# EAGLE board LinuxBoard_v1.91 (EAGLE 7.2.0)
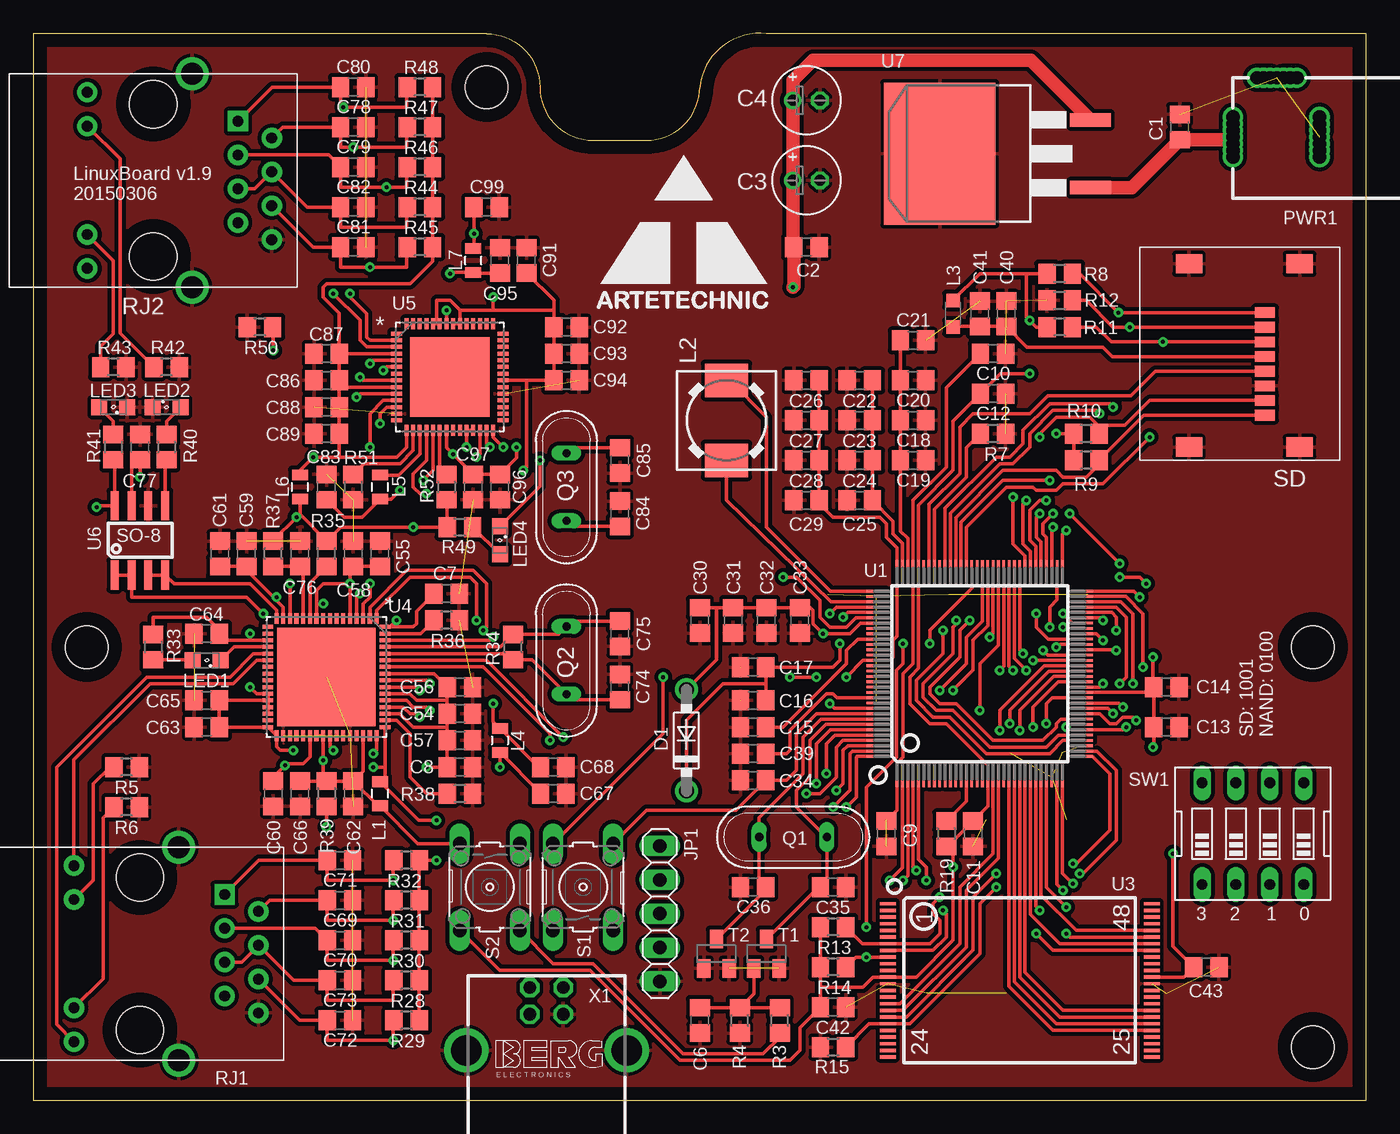
[diagram p2: board, top side]
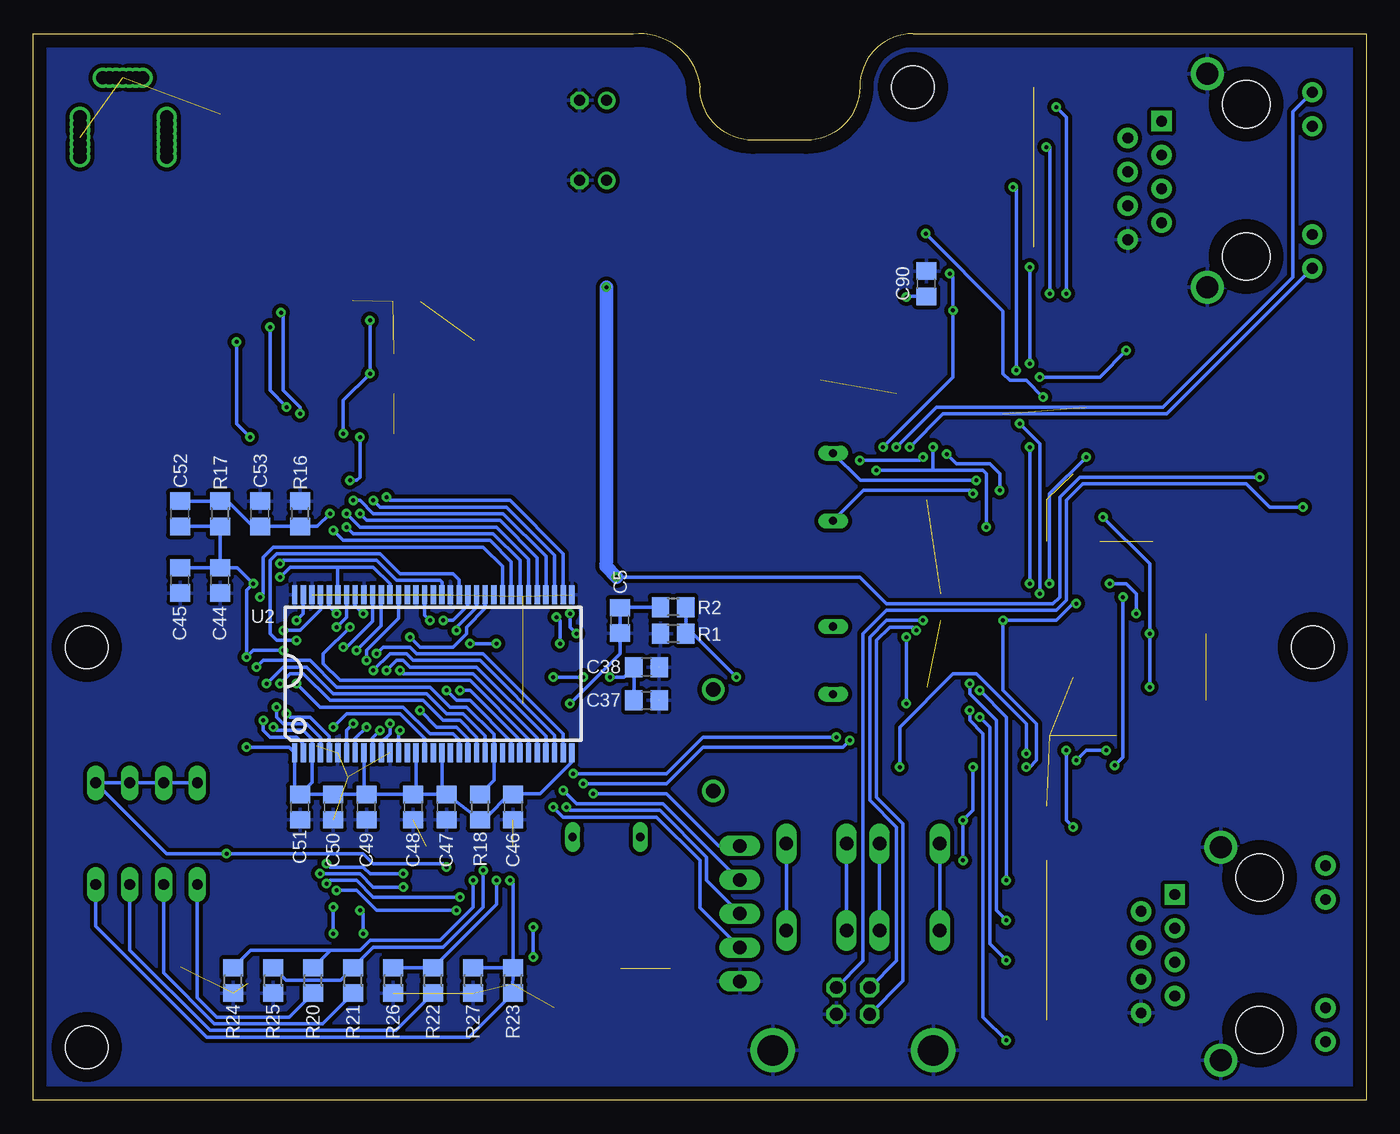
[diagram p3: board, bottom side, seen from below]

Size 100 x 80.03 mm. Coordinates in mm from the lower left corner, seen from the top.
Outline: 0,0 100,0 100,80 55,80 arc90 50,76 arc-90 46,72 42,72 arc-90 38,76 arc90 34,80 0,80 0,0
Copper layers (1*16): Top 0.035mm / dielectric 1.5mm / Bottom 0.035mm
Design rules "default *": minimum track width 10mil, minimum drill 24mil, track to track 8mil, track to pad 8mil, pad to pad 8mil, via to via 8mil, smd to smd 8mil, copper to edge 40mil, drill to drill 8mil, minimum pad ring 10mil, minimum via ring 8mil, stop-mask expansion 4mil, vias tented up to drill 12mil, thermal gap 10mil
Net classes: 1 pwr: width 0.5 mm, clearance 0.2 mm
Holes 3.2 mm at 4,34 96,34 96,4 34,76

## Footprints (pad centres in the part's own frame; a part is rotated, then mirrored left to right if it is on the bottom)
C0805 = smd 1.3 x 1.5: 1 -0.95,0; 2 0.95,0
E2-5 = drill 0.813 pad 1.27: + -1.016,0 | drill 0.813 pad 1.27 octagon: - 1.016,0
DO41-7.6 = drill 1.1 pad 1.7: A 3.81,0; C -3.81,0
1X05 = drill 1.016 long: 1 -5.08,0; 2 -2.54,0; 3 0,0; 4 2.54,0; 5 5.08,0
0805 = smd 0.8 x 1.2: 1 -0.9,0; 2 0.9,0
DR73 = smd 2.5 x 3.25: 1 -3,0; 2 3,0
L2012C = smd 1 x 1: 1 -1,0; 2 1,0
SML0805 = smd 1.2 x 1.2: A 1.05,0; C -1.05,0
PWR_JACK_UNI_MILLING = drill 1: + 0,4.75; +1 0,5.25; +2 0,5.75; +3 0,6.25; +4 0,4.25; +5 0,3.75; +6 0,3.25; - -6.5,4.75; -1 -6.5,5.25; -2 -6.5,5.75; -3 -6.5,4.25; -4 -6.5,3.75; -5 -6.5,6.25; -6 -6.5,3.25; -- -3.3,0.3; --1 -3.8,0.3; --2 -4.3,0.3; --3 -4.8,0.3; --4 -2.8,0.3; --5 -2.3,0.3; --6 -1.8,0.3
QS = drill 0.61 long: 1 -2.54,0; 2 2.54,0
R0805 = smd 1.3 x 1.5: 1 -0.95,0; 2 0.95,0
HR911105A = drill 0.813 pad 1.524: G+ 4.953,-6.604; G- 4.953,-4.064; GND -8.89,4.445; NC -6.35,3.175; P4 -8.89,-0.635; P5 -6.35,0.635; RD+ -6.35,-1.905; RD- -8.89,1.905; TD- -8.89,-3.175; Y+ 4.953,6.604; Y- 4.953,4.064 | drill 1.651 pad 2.159: SHIELD0 -2.921,8.001; SHIELD1 -2.921,-8.001 | drill 0.813 pad 1.524 square: TD+ -6.35,-4.445 | hole 3.556: 0,-5.715; 0,5.715
B3F-10XX = drill 1.016 long: 1 -3.251,2.261; 2 3.251,2.261; 3 -3.251,-2.261; 4 3.251,-2.261
MX-47219-2001 = smd 0.8 x 1.5: 1 10.08,2.6; 2 8.98,2.6; 3 7.88,2.6; 4 6.78,2.6; 5 5.68,2.6; 6 4.58,2.6; 7 3.48,2.6; 8 2.38,2.6 | smd 1.45 x 2: G1 13.75,0; G2 13.75,8.3; G3 0,8.3; G4 0,0
EDG-04 = drill 0.813 long: 1 -3.81,-3.81; 2 -1.27,-3.81; 3 1.27,-3.81; 4 3.81,-3.81; 5 3.81,3.81; 6 1.27,3.81; 7 -1.27,3.81; 8 -3.81,3.81
SOT23 = smd 1 x 1.4: 1 -0.95,-1.1; 2 0.95,-1.1; 3 0,1.1
TQFP128LD = smd 0.2 x 1.5: 1 -6.2,-7.75; 2 -5.8,-7.75; 3 -5.4,-7.75; 4 -5,-7.75; 5 -4.6,-7.75; 6 -4.2,-7.75; 7 -3.8,-7.75; 8 -3.4,-7.75; 9 -3,-7.75; 10 -2.6,-7.75; 11 -2.2,-7.75; 12 -1.8,-7.75; 13 -1.4,-7.75; 14 -1,-7.75; 15 -0.6,-7.75; 16 -0.2,-7.75; 17 0.2,-7.75; 18 0.6,-7.75; 19 1,-7.75; 20 1.4,-7.75; 21 1.8,-7.75; 22 2.2,-7.75; 23 2.6,-7.75; 24 3,-7.75; 25 3.4,-7.75; 26 3.8,-7.75; 27 4.2,-7.75; 28 4.6,-7.75; 29 5,-7.75; 30 5.4,-7.75; 31 5.8,-7.75; 32 6.2,-7.75; 65 6.2,7.75; 66 5.8,7.75; 67 5.4,7.75; 68 5,7.75; 69 4.6,7.75; 70 4.2,7.75; 71 3.8,7.75; 72 3.4,7.75; 73 3,7.75; 74 2.6,7.75; 75 2.2,7.75; 76 1.8,7.75; 77 1.4,7.75; 78 1,7.75; 79 0.6,7.75; 80 0.2,7.75; 81 -0.2,7.75; 82 -0.6,7.75; 83 -1,7.75; 84 -1.4,7.75; 85 -1.8,7.75; 86 -2.2,7.75; 87 -2.6,7.75; 88 -3,7.75; 89 -3.4,7.75; 90 -3.8,7.75; 91 -4.2,7.75; 92 -4.6,7.75; 93 -5,7.75; 94 -5.4,7.75; 95 -5.8,7.75; 96 -6.2,7.75 | smd 1.5 x 0.2: 33 7.75,-6.2; 34 7.75,-5.8; 35 7.75,-5.4; 36 7.75,-5; 37 7.75,-4.6; 38 7.75,-4.2; 39 7.75,-3.8; 40 7.75,-3.4; 41 7.75,-3; 42 7.75,-2.6; 43 7.75,-2.2; 44 7.75,-1.8; 45 7.75,-1.4; 46 7.75,-1; 47 7.75,-0.6; 48 7.75,-0.2; 49 7.75,0.2; 50 7.75,0.6; 51 7.75,1; 52 7.75,1.4; 53 7.75,1.8; 54 7.75,2.2; 55 7.75,2.6; 56 7.75,3; 57 7.75,3.4; 58 7.75,3.8; 59 7.75,4.2; 60 7.75,4.6; 61 7.75,5; 62 7.75,5.4; 63 7.75,5.8; 64 7.75,6.2; 97 -7.75,6.2; 98 -7.75,5.8; 99 -7.75,5.4; 100 -7.75,5; 101 -7.75,4.6; 102 -7.75,4.2; 103 -7.75,3.8; 104 -7.75,3.4; 105 -7.75,3; 106 -7.75,2.6; 107 -7.75,2.2; 108 -7.75,1.8; 109 -7.75,1.4; 110 -7.75,1; 111 -7.75,0.6; 112 -7.75,0.2; 113 -7.75,-0.2; 114 -7.75,-0.6; 115 -7.75,-1; 116 -7.75,-1.4; 117 -7.75,-1.8; 118 -7.75,-2.2; 119 -7.75,-2.6; 120 -7.75,-3; 121 -7.75,-3.4; 122 -7.75,-3.8; 123 -7.75,-4.2; 124 -7.75,-4.6; 125 -7.75,-5; 126 -7.75,-5.4; 127 -7.75,-5.8; 128 -7.75,-6.2
66TSOP-II = smd 0.4 x 1.4: 1 -10.4,-5.925; 2 -9.75,-5.925; 3 -9.1,-5.925; 4 -8.45,-5.925; 5 -7.8,-5.925; 6 -7.15,-5.925; 7 -6.5,-5.925; 8 -5.85,-5.925; 9 -5.2,-5.925; 10 -4.55,-5.925; 11 -3.9,-5.925; 12 -3.25,-5.925; 13 -2.6,-5.925; 14 -1.95,-5.925; 15 -1.3,-5.925; 16 -0.65,-5.925; 17 0,-5.925; 18 0.65,-5.925; 19 1.3,-5.925; 20 1.95,-5.925; 21 2.6,-5.925; 22 3.25,-5.925; 23 3.9,-5.925; 24 4.55,-5.925; 25 5.2,-5.925; 26 5.85,-5.925; 27 6.5,-5.925; 28 7.15,-5.925; 29 7.8,-5.925; 30 8.45,-5.925; 31 9.1,-5.925; 32 9.75,-5.925; 33 10.4,-5.925; 34 10.4,5.925; 35 9.75,5.925; 36 9.1,5.925; 37 8.45,5.925; 38 7.8,5.925; 39 7.15,5.925; 40 6.5,5.925; 41 5.85,5.925; 42 5.2,5.925; 43 4.55,5.925; 44 3.9,5.925; 45 3.25,5.925; 46 2.6,5.925; 47 1.95,5.925; 48 1.3,5.925; 49 0.65,5.925; 50 0,5.925; 51 -0.65,5.925; 52 -1.3,5.925; 53 -1.95,5.925; 54 -2.6,5.925; 55 -3.25,5.925; 56 -3.9,5.925; 57 -4.55,5.925; 58 -5.2,5.925; 59 -5.85,5.925; 60 -6.5,5.925; 61 -7.15,5.925; 62 -7.8,5.925; 63 -8.45,5.925; 64 -9.1,5.925; 65 -9.75,5.925; 66 -10.4,5.925
TSOP48 = smd 1.2 x 0.25: 1 -9.9,5.75; 2 -9.9,5.25; 3 -9.9,4.75; 4 -9.9,4.25; 5 -9.9,3.75; 6 -9.9,3.25; 7 -9.9,2.75; 8 -9.9,2.25; 9 -9.9,1.75; 10 -9.9,1.25; 11 -9.9,0.75; 12 -9.9,0.25; 13 -9.9,-0.25; 14 -9.9,-0.75; 15 -9.9,-1.25; 16 -9.9,-1.75; 17 -9.9,-2.25; 18 -9.9,-2.75; 19 -9.9,-3.25; 20 -9.9,-3.75; 21 -9.9,-4.25; 22 -9.9,-4.75; 23 -9.9,-5.25; 24 -9.9,-5.75; 25 9.9,-5.75; 26 9.9,-5.25; 27 9.9,-4.75; 28 9.9,-4.25; 29 9.9,-3.75; 30 9.9,-3.25; 31 9.9,-2.75; 32 9.9,-2.25; 33 9.9,-1.75; 34 9.9,-1.25; 35 9.9,-0.75; 36 9.9,-0.25; 37 9.9,0.25; 38 9.9,0.75; 39 9.9,1.25; 40 9.9,1.75; 41 9.9,2.25; 42 9.9,2.75; 43 9.9,3.25; 44 9.9,3.75; 45 9.9,4.25; 46 9.9,4.75; 47 9.9,5.25; 48 9.9,5.75
QFN50P900X900X100-65N = smd 0.813 x 0.305: 1 -4.394,3.759; 2 -4.394,3.251; 3 -4.394,2.743; 4 -4.394,2.261; 5 -4.394,1.753; 6 -4.394,1.245; 7 -4.394,0.762; 8 -4.394,0.254; 9 -4.394,-0.254; 10 -4.394,-0.762; 11 -4.394,-1.245; 12 -4.394,-1.753; 13 -4.394,-2.261; 14 -4.394,-2.743; 15 -4.394,-3.251; 16 -4.394,-3.759; 33 4.394,-3.759; 34 4.394,-3.251; 35 4.394,-2.743; 36 4.394,-2.261; 37 4.394,-1.753; 38 4.394,-1.245; 39 4.394,-0.762; 40 4.394,-0.254; 41 4.394,0.254; 42 4.394,0.762; 43 4.394,1.245; 44 4.394,1.753; 45 4.394,2.261; 46 4.394,2.743; 47 4.394,3.251; 48 4.394,3.759 | smd 0.305 x 0.813: 17 -3.759,-4.394; 18 -3.251,-4.394; 19 -2.743,-4.394; 20 -2.261,-4.394; 21 -1.753,-4.394; 22 -1.245,-4.394; 23 -0.762,-4.394; 24 -0.254,-4.394; 25 0.254,-4.394; 26 0.762,-4.394; 27 1.245,-4.394; 28 1.753,-4.394; 29 2.261,-4.394; 30 2.743,-4.394; 31 3.251,-4.394; 32 3.759,-4.394; 49 3.759,4.394; 50 3.251,4.394; 51 2.743,4.394; 52 2.261,4.394; 53 1.753,4.394; 54 1.245,4.394; 55 0.762,4.394; 56 0.254,4.394; 57 -0.254,4.394; 58 -0.762,4.394; 59 -1.245,4.394; 60 -1.753,4.394; 61 -2.261,4.394; 62 -2.743,4.394; 63 -3.251,4.394; 64 -3.759,4.394 | smd 7.391 x 7.391: 65 0,0
QFN50P800X800X100-57N = smd 0.813 x 0.305: 1 -3.988,3.251; 2 -3.988,2.743; 3 -3.988,2.261; 4 -3.988,1.753; 5 -3.988,1.245; 6 -3.988,0.762; 7 -3.988,0.254; 8 -3.988,-0.254; 9 -3.988,-0.762; 10 -3.988,-1.245; 11 -3.988,-1.753; 12 -3.988,-2.261; 13 -3.988,-2.743; 14 -3.988,-3.251; 29 3.988,-3.251; 30 3.988,-2.743; 31 3.988,-2.261; 32 3.988,-1.753; 33 3.988,-1.245; 34 3.988,-0.762; 35 3.988,-0.254; 36 3.988,0.254; 37 3.988,0.762; 38 3.988,1.245; 39 3.988,1.753; 40 3.988,2.261; 41 3.988,2.743; 42 3.988,3.251 | smd 0.305 x 0.813: 15 -3.251,-3.988; 16 -2.743,-3.988; 17 -2.261,-3.988; 18 -1.753,-3.988; 19 -1.245,-3.988; 20 -0.762,-3.988; 21 -0.254,-3.988; 22 0.254,-3.988; 23 0.762,-3.988; 24 1.245,-3.988; 25 1.753,-3.988; 26 2.261,-3.988; 27 2.743,-3.988; 28 3.251,-3.988; 43 3.251,3.988; 44 2.743,3.988; 45 2.261,3.988; 46 1.753,3.988; 47 1.245,3.988; 48 0.762,3.988; 49 0.254,3.988; 50 -0.254,3.988; 51 -0.762,3.988; 52 -1.245,3.988; 53 -1.753,3.988; 54 -2.261,3.988; 55 -2.743,3.988; 56 -3.251,3.988 | smd 5.994 x 5.994: 57 0,0
SO-8 = smd 0.6 x 2.2: 1 -1.905,-2.6; 2 -0.635,-2.6; 3 0.635,-2.6; 4 1.905,-2.6; 5 1.905,2.6; 6 0.635,2.6; 7 -0.635,2.6; 8 -1.905,2.6
D2PAK-3 = smd 1.016 x 3.05: 1 -2.54,-11.31; 3 2.54,-11.31 | smd 10.66 x 8.38: 4 0,0
PN61729-S = drill 0.95 octagon: 1 1.25,4.71; 2 -1.25,4.71; 3 -1.25,2.71; 4 1.25,2.71 | drill 2.3 pad 2.9: S1 -6.02,0; S2 6.02,0

## Placement (x,y rotation side)
C1  0.33uF  [C0805]  86,73 90 top
C2  0.1uF  [C0805]  58,64 0 top
C3  4.7uF  [E2-5]  58,69 0 top
C4  220uF  [E2-5]  58,75 0 top
C5  0.1uF  [C0805]  56,36 270 bottom
C6  0.1uF  [C0805]  50,6 270 top
C7  0.1uF  [C0805]  31,38 0 top
C8  0.1uF  [C0805]  32,25 0 top
C9  0.1uF  [C0805]  64,20 270 top
C10  0.1uF  [C0805]  72,56 0 top
C11  0.1uF  [C0805]  70.5,20 270 top
C12  0.1uF  [C0805]  72,53 0 top
C13  0.1uF  [C0805]  85,28 0 top
C14  0.1uF  [C0805]  85,31 0 top
C15  1uF  [C0805]  54,28 180 top
C16  1uF  [C0805]  54,30 180 top
C17  0.1uF  [C0805]  54,32.5 180 top
C18  0.01uF  [C0805]  66,51 0 top
C19  0.1uF  [C0805]  66,48 0 top
C20  1uF  [C0805]  66,54 0 top
C21  33uF  [C0805]  66,57 0 top
C22  0.01uF  [C0805]  62,54 180 top
C23  0.1uF  [C0805]  62,51 180 top
C24  1uF  [C0805]  62,48 180 top
C25  33uF  [C0805]  62,45 180 top
C26  0.01uF  [C0805]  58,54 180 top
C27  0.1uF  [C0805]  58,51 180 top
C28  1uF  [C0805]  58,48 180 top
C29  33uF  [C0805]  58,45 180 top
C30  0.01uF  [C0805]  50,36 270 top
C31  0.1uF  [C0805]  52.5,36 270 top
C32  1uF  [C0805]  55,36 270 top
C33  33uF  [C0805]  57.5,36 270 top
C34  0.1uF  [C0805]  54,24 180 top
C35  10pF  [C0805]  60,16 180 top
C36  10pF  [C0805]  54,16 0 top
C37  0.1uF  [C0805]  54,30 0 bottom
C38  1uF  [C0805]  54,32.5 0 bottom
C39  1uF  [C0805]  54,26 0 top
C40  22uF  [C0805]  73,59 270 top
C41  22uF  [C0805]  71,59 270 top
C42  0.1uF  [C0805]  60,7 180 top
C43  22uF  [C0805]  88,10 180 top
C44  0.1uF  [C0805]  86,39 90 bottom
C45  0.1uF  [C0805]  89,39 90 bottom
C46  0.1uF  [C0805]  64,22 90 bottom
C47  0.1uF  [C0805]  69,22 90 bottom
C48  0.1uF  [C0805]  71.5,22 90 bottom
C49  0.1uF  [C0805]  75,22 90 bottom
C50  0.1uF  [C0805]  77.5,22 90 bottom
C51  0.1uF  [C0805]  80,22 90 bottom
C52  0.1uF  [C0805]  89,44 270 bottom
C53  0.1uF  [C0805]  83,44 270 bottom
C54  0.1uF  [C0805]  32,29 0 top
C55  0.1uF  [C0805]  26,41 90 top
C56  0.1uF  [C0805]  32,31 0 top
C57  0.1uF  [C0805]  32,27 0 top
C58  0.1uF  [C0805]  24,41 90 top
C59  0.1uF  [C0805]  16,41 90 top
C60  0.1uF  [C0805]  18,23 270 top
C61  4.7uF  [C0805]  14,41 90 top
C62  0.1uF  [C0805]  24,23 270 top
C63  0.1uF  [C0805]  13,28 180 top
C64  0.1uF  [C0805]  13,35 180 top
C65  0.1uF  [C0805]  13,30 180 top
C66  0.1uF  [C0805]  20,23 270 top
C67  0.1uF  [C0805]  39,23 0 top
C68  0.1uF  [C0805]  39,25 0 top
C69  15pF  [C0805]  23,15 0 top
C70  15pF  [C0805]  23,12 0 top
C71  15pF  [C0805]  23,18 0 top
C72  15pF  [C0805]  23,6 0 top
C73  22nF  [C0805]  23,9 0 top
C74  33pF  [C0805]  44,31 90 top
C75  33pF  [C0805]  44,35 270 top
C76  10nF  [C0805]  20,41 90 top
C77  10uF  [C0805]  8,49 270 top
C78  15pF  [C0805]  24,73 0 top
C79  15pF  [C0805]  24,70 0 top
C80  15pF  [C0805]  24,76 0 top
C81  15pF  [C0805]  24,64 0 top
C82  22nF  [C0805]  24,67 0 top
C83  0.1uF  [C0805]  22,46 90 top
C84  33pF  [C0805]  44,44 90 top
C85  33pF  [C0805]  44,48 270 top
C86  0.1uF  [C0805]  22,54 180 top
C87  0.1uF  [C0805]  22,56 180 top
C88  0.1uF  [C0805]  22,52 180 top
C89  0.1uF  [C0805]  22,50 180 top
C90  0.1uF  [C0805]  33,61.25 90 bottom
C91  0.1uF  [C0805]  37,63 90 top
C92  0.1uF  [C0805]  40,58 0 top
C93  0.1uF  [C0805]  40,56 0 top
C94  0.1uF  [C0805]  40,54 0 top
C95  0.1uF  [C0805]  35,63 90 top
C96  0.1uF  [C0805]  35,46 270 top
C97  0.1uF  [C0805]  33,46 270 top
C99  0.1uF  [C0805]  34,67 0 top
D1  1N5819-B  [DO41-7.6]  49,27 90 top
JP1  UART  [1X05]  47,14 270 top
L1  LCBB-601  [0805]  26,23 90 top
L2  DE0703-15  [DR73]  52,51 90 top
L3  CW0805-470  [L2012C]  69,59 270 top
L4  LCBB-601  [0805]  35,27 270 top
L5  LCBB-601  [0805]  26,46 90 top
L6  LCBB-601  [0805]  20,46 90 top
L7  LCBB-601  [0805]  33,63 90 top
LED1  [SML0805]  13,33 180 top
LED2  [SML0805]  10,52 0 top
LED3  [SML0805]  6,52 180 top
LED4  [SML0805]  35,42 270 top
PWR1  [PWR_JACK_UNI_MILLING]  90,77 180 top
Q1  XTAL-24M  [QS]  57,19.75 0 top
Q2  25.00MHz  [QS]  40,33 90 top
Q3  25.00MHz  [QS]  40,46 90 top
R1  100k  [R0805]  52,35 180 bottom
R2  1k  [R0805]  52,37 180 bottom
R3  1k  [R0805]  56,6 90 top
R4  1k  [R0805]  53,6 90 top
R5  330  [R0805]  7,25 180 top
R6  330  [R0805]  7,22 180 top
R7  100k  [R0805]  72,50 180 top
R8  100k  [R0805]  77,62 180 top
R9  100k  [R0805]  79,48 180 top
R10  100k  [R0805]  79,50 180 top
R11  10k  [R0805]  77,58 180 top
R12  1M  [R0805]  77,60 0 top
R13  47k  [R0805]  60,13 180 top
R14  47k  [R0805]  60,10 180 top
R15  47k  [R0805]  60,4 0 top
R16  47k  [R0805]  80,44 270 bottom
R17  47k  [R0805]  86,44 270 bottom
R18  10k  [R0805]  66.5,22 270 bottom
R19  47k  [R0805]  68.5,20 270 top
R20  4.7k  [R0805]  79,9 90 bottom
R21  4.7k  [R0805]  76,9 90 bottom
R22  4.7k  [R0805]  70,9 90 bottom
R23  4.7k  [R0805]  64,9 90 bottom
R24  47k  [R0805]  85,9 90 bottom
R25  47k  [R0805]  82,9 90 bottom
R26  47k  [R0805]  73,9 90 bottom
R27  47k  [R0805]  67,9 90 bottom
R28  10  [R0805]  28,9 180 top
R29  49.9  [R0805]  28,6 180 top
R30  49.9  [R0805]  28,12 180 top
R31  49.9  [R0805]  28,15 180 top
R32  49.9  [R0805]  28,18 180 top
R33  330  [R0805]  9,34 270 top
R34  1M  [R0805]  36,34 90 top
R35  10k  [R0805]  22,41 90 top
R36  12k  [R0805]  31,36 180 top
R37  10k  [R0805]  18,41 90 top
R38  12.4k  [R0805]  32,23 180 top
R39  10k  [R0805]  22,23 270 top
R40  510  [R0805]  10,49 270 top
R41  510  [R0805]  6,49 270 top
R42  330  [R0805]  10,55 180 top
R43  330  [R0805]  6,55 180 top
R44  10  [R0805]  29,67 180 top
R45  49.9  [R0805]  29,64 180 top
R46  49.9  [R0805]  29,70 180 top
R47  49.9  [R0805]  29,73 180 top
R48  49.9  [R0805]  29,76 180 top
R49  330  [R0805]  32,43 0 top
R50  12k  [R0805]  17,58 180 top
R51  12k  [R0805]  24,46 270 top
R52  0 or 10k  [R0805]  31,46 270 top
RJ1  HR911105A  [HR911105A]  8,11 180 top
RJ2  HR911105A  [HR911105A]  9,69 180 top
S1  POWER  [B3F-10XX]  41.25,16 90 top
S2  RESET  [B3F-10XX]  34.25,16 270 top
SD  MX-47219-2001  [MX-47219-2001]  95,49 90 top
SW1  [EDG-04]  91.5,20 0 top
T1  BC846  [SOT23]  55,11 0 top
T2  BC846  [SOT23]  51.25,11 0 top
U1  MCIMX233DAG4B_LD  [TQFP128LD]  71,32 0 top
U2  H5DU5162ETR-E3C  [66TSOP-II]  70,32 0 bottom
U3  EN27LN4G08  [TSOP48]  74,9 0 top
U4  LAN9512-JZX  [QFN50P900X900X100-65N]  22,31.75 270 top
U5  LAN9500A-ABZJ  [QFN50P800X800X100-57N]  31.25,54.25 0 top
U6  MIC2026-1YM  [SO-8]  8,42 0 top
U7  L7805CD2T  [D2PAK-3]  68,71 90 top
X1  PN61729-S  [PN61729-S]  38.5,3.75 0 top

## Tracks (layer width: path | path; a pad name or v marks a point on that pad's centre or on a via)
1V2
  Top 0.254: C9.1 64.8,21.75 U1.1 64.8,25.3 65.25,25.75 65.25,32 66,32.75 U1.93 66,45 68.5,47.5 68.5,53.45 C10.1
3V3  (via drill 0.3)
  Top 0.254: 59.05,8.5 R14.2 R13.2 | 59.05,8.5 C42.2 | 59.05,8.5 62.25,8.5 63,9.25 U3.12 66.25,9.25 69,12 v69,17.5 69,18.55 R19.2 69,19.05 | 59.05,6.8 C42.2 | R8.2 74.5,62 | 74.5,62 71,62 L3.1 | R11.2 75.25,58 v74.75,58.5 74.5,58.75 74.5,62 | R9.2 R10.2 v76.75,50 | v74.75,54.5 72.55,54.5 C12.1 69,50.95 69,47.25 66.4,44.65 U1.92 66.4,32.4 65.75,31.75 65.75,29.75 67.25,28.25 68.5,28.25 71.6,25.15 U1.18 71.6,22.05 C11.1 69,19.45 69,19.05 | 69,19.05 69.1,19.05 | U3.37 86.3,9.25 C43.2 85.5,11.55 v85.5,18.5 | U4.28 C65.1 C63.1 U4.32 U4.33 18.24,26.51 18.5,26.25 v19.5,26.25 | U4.30 U4.29 U4.28 | U4.28 | U4.28 17.75,30 | U4.28 U4.27 16.75,30.5 v16.25,31 | 16.25,34.49 14.46,34.49 C64.1 13.95,35.3 13,36.25 9,36.25 R33.1 | 16.25,34.49 U4.19 | U4.46 24.74,24.69 C62.1 | C62.1 25.85,22.1 L1.1 28.85,19.25 S2.3 | U4.39 U4.40 v21.75,25.5 21.75,24.2 R39.1 | C66.1 R39.1 | R39.1 C62.1 | C91.1 39.05,60 39.05,59.25 | 39.05,59.25 C92.1 C93.1 C94.1 39,54 | L6.1 20,44 | 20,44 20,43.95 R35.2 23.05,43 v28.5,43 R49.1 31.05,45 R52.2 | R37.2 18,42 v19.75,43.75 20,44 | U5.25 U5.24 v32.5,49 | v16.25,35 16.25,34.49 | U5.52 U5.51 30.25,58.48 30.25,60 31.26,60 32.01,59.25 | 37,54 39,54 | 39,54 | U5.49 U5.48 32.01,59.25 | 32.01,59.25 32,59.25 | 32.01,59.25 34.5,59.25 | 34.5,59.25 39.05,59.25 | U5.35 37,54 | 37,54 37,47.5 v36.75,47.25 | v34.5,60.25 34.5,59.25 | S2.4 34.99,9.75 41.75,9.75 48.5,3 56.75,3 57.5,3.75 57.5,5.45 C42.2
  Bottom 0.254: v74.75,58.5 v74.75,54.5 76.75,52.5 v76.75,50 | v69,17.5 69.25,17.75 74.5,17.75 75.25,18.5 v85.5,18.5 90,18.5 SW1.5 SW1.6 SW1.7 SW1.8 | v19.5,26.25 21,26.25 v21.75,25.5 | v19.75,43.75 16.25,40.25 v16.25,35 v16.25,31 | S2.3 S2.4 | v32.5,49 32.5,47.25 | 32.5,47.25 28.75,47.25 28.5,47 v28.5,43 | v36.75,47.25 32.5,47.25 | C90.1 34.45,60.3 v34.5,60.25
5V0  (via drill 0.3)
  Top 0.254: U1.102 61.7,36.2 61,35.5 59.75,35.5 59,36.25 59,37.5 57.25,39.25 v56.25,39.25 | U6.7 7.37,47.41 C77.2 v8,46.75
  Top 1.016: U7.3 74.85,78 58.5,78 57,76.5 57,75.02 C4.+ C3.+ 56.98,64.07 C2.1 57.05,61.05 v57,61
  Bottom 0.254: v8,46.75 21.5,46.75 23,45.25 23,37.75 23.5,37.25 36,37.25 38,39.25 v56.25,39.25
  Bottom 1.016: v56.25,39.25 57.05,40.05 57,40.6 v57,61
AUART1_RX  (via drill 0.3)
  Top 0.254: v61,22 61.75,22.75 61.75,25.75 61.8,25.8 U1.128
  Bottom 0.254: JP1.4 50,14.46 50,18 53.25,21.25 60.25,21.25 v61,22
AUART1_TX  (via drill 0.3)
  Top 0.254: U1.127 61.45,26.2 61.25,26 61.25,23.25 v60,22
  Bottom 0.254: v60,22 59.75,21.75 53,21.75 49.5,18.25 49.5,16.5 JP1.3
DCDC_BATTERY  (via drill 0.3)
  Top 0.254: C30.1 51.25,36.95 | 51.25,36.95 C31.1 C32.1 C33.1 58.3,36.95 58.5,36.75 58.5,35.75 v59.25,35 61.25,35 62.05,35.8 U1.103 | U1.100 60.25,37 v59.75,36.5 | D1.A 51.25,33.06 51.25,36.95
  Bottom 0.254: v59.75,36.5 59.75,35.5 v59.25,35
DCDC_VDDA  (via drill 0.3)
  Top 0.254: v61,31.75 62.25,33 U1.110 64.25,33 64.5,33.25 64.5,34.5 64.8,34.8 U1.96 64.8,41.45 64,42.25 64,43.25 63.5,43.75 60,43.75 58.95,44.8 C29.1 C28.1 C27.1 C26.1 | v58.75,31.75 v56.75,31.75
  Bottom 0.254: v61,31.75 v58.75,31.75 | v56.75,31.75 55.7,31.75 C38.1 C37.1
DCDC_VDDD
  Top 0.254: U1.94 65.6,42.15 65.05,42.7 C19.1 C18.1 C20.1 C21.1
DCDC_VDDIO
  Top 0.254: U1.95 65.2,41.8 64.5,42.5 64.5,43.45 C25.1 C24.1 C23.1 C22.1
DEBUG
  Top 0.254: U1.89 67.6,44.35 70,46.75 70,48.95 R7.2
DUART_RX  (via drill 0.3)
  Top 0.254: U1.125 60.75,27 60.25,26.5 60.25,24.25 59,23 v58,23
  Bottom 0.254: v58,23 52.5,23 48.58,19.08 JP1.1
DUART_TX  (via drill 0.3)
  Top 0.254: v60.25,23.25 60.75,23.75 60.75,26.25 61.1,26.6 U1.126
  Bottom 0.254: JP1.2 47.04,16.54 52.75,22.25 59.25,22.25 v60.25,23.25
EMI_A00  (via drill 0.3)
  Top 0.254: U1.76 72.8,32.55 v72.5,32.25
  Bottom 0.254: U2.29 62.2,27.2 67,32 72.25,32 v72.5,32.25
EMI_A01  (via drill 0.3)
  Top 0.254: U1.75 73.2,32.55 v73.5,32.25
  Bottom 0.254: v73.5,32.25 72.75,33 72.25,33 71.75,32.5 66.75,32.5 61.55,27.3 U2.30
EMI_A02  (via drill 0.3)
  Top 0.254: U1.74 73.6,33.15 v74.5,32.25
  Bottom 0.254: v74.5,32.25 73.25,33.5 72,33.5 71.5,33 66.5,33 60.9,27.4 U2.31
EMI_A03  (via drill 0.3)
  Top 0.254: U1.73 74,33.75 v74.25,33.5
  Bottom 0.254: v74.25,33.5 73.75,34 71.75,34 71.25,33.5 66.25,33.5 60.25,27.5 U2.32
EMI_A04  (via drill 0.3)
  Top 0.254: v73.5,45.25 73.5,41.75 74.4,40.85 U1.72
  Bottom 0.254: U2.35 60.25,41 64.25,45 73.25,45 v73.5,45.25
EMI_A05  (via drill 0.3)
  Top 0.254: v74.5,45 74.25,44.75 74.25,41.75 74.8,41.2 U1.71
  Bottom 0.254: U2.36 60.9,40.9 64.5,44.5 74,44.5 v74.5,45
EMI_A06  (via drill 0.3)
  Top 0.254: U1.70 75.2,41.55 74.75,42 74.75,44.25 75.5,45 v76,45
  Bottom 0.254: U2.37 61.55,40.8 64.75,44 74.5,44 75.5,45 v76,45
EMI_A07  (via drill 0.3)
  Top 0.254: v75.5,44 75.25,43.75 75.25,42.25 75.6,41.9 U1.69
  Bottom 0.254: U2.38 62.2,40.7 65,43.5 75,43.5 v75.5,44
EMI_A08  (via drill 0.3)
  Top 0.254: v76.5,44 75.75,43.25 75.75,42.5 76,42.25 U1.68
  Bottom 0.254: U2.39 62.85,40.6 65.25,43 75.5,43 v76.5,44
EMI_A09  (via drill 0.3)
  Top 0.254: v76.5,43 76.4,42.9 U1.67
  Bottom 0.254: U2.40 63.5,40.5 65.5,42.5 76,42.5 v76.5,43
EMI_A10  (via drill 0.3)
  Top 0.254: v76.25,35.5 76.25,37 76.8,37.55 U1.66
  Bottom 0.254: v76.25,35.5 78.25,33.5 78.25,32.75 77,31.5 67.25,31.5 62.85,27.1 U2.28
EMI_A11  (via drill 0.3)
  Top 0.254: v77.5,42.75 77.2,42.45 U1.65
  Bottom 0.254: U2.41 64.15,40.4 65.75,42 76.75,42 v77.5,42.75
EMI_A12  (via drill 0.3)
  Top 0.254: v83,37.75 82.55,38.2 U1.64
  Bottom 0.254: U2.42 64.8,40.05 66.25,41.5 82,41.5 82.75,40.75 82.75,38 v83,37.75
EMI_BA0  (via drill 0.3)
  Top 0.254: U1.79 71.6,35.6 70.5,34.5 70.5,32.25 v69,30.75
  Bottom 0.254: U2.26 64.15,26.9 67.25,30 68.25,30 v69,30.75
EMI_BA1  (via drill 0.3)
  Top 0.254: U1.80 71.2,35.95 70,34.75 70,32.75 v68,30.75
  Bottom 0.254: U2.27 63.5,27 67.25,30.75 v68,30.75
EMI_CASN  (via drill 0.3)
  Top 0.254: U1.61 81.25,37 82,36.25 82,31.75 v81.5,31.25
  Bottom 0.254: U2.22 66.75,27.25 68,28.5 69.25,28.5 70.75,30 77.75,30 79.75,32 80.75,32 v81.5,31.25
EMI_CE0N  (via drill 0.3)
  Top 0.254: v83.25,32.5 83.25,36.5 81.95,37.8 U1.63
  Bottom 0.254: R18.1 65.45,24 U2.24 65.45,27.45 67.5,29.5 68.75,29.5 70.25,31 77.25,31 79.25,33 82.75,33 v83.25,32.5
EMI_CKE  (via drill 0.3)
  Top 0.254: U1.78 72,35 v71.75,34.75
  Bottom 0.254: v71.75,34.75 71,34 68.5,34 67.5,35 67.5,35.5 66.1,36.9 U2.44
EMI_CLK  (via drill 0.3)
  Top 0.254: U1.36 77.25,27 76.25,26 71.5,26 68.75,28.75 67.5,28.75 66.25,30 66.25,31.5 68.25,33.5 v68.25,35.25
  Bottom 0.254: U2.45 66.75,37 68.25,35.5 v68.25,35.25
EMI_CLKN  (via drill 0.3)
  Top 0.254: U1.37 76.9,27.4 76,26.5 71.75,26.5 69,29.25 67.75,29.25 66.75,30.25 66.75,31.25 69,33.5 69,35.5 69.25,35.75 v69.25,36
  Bottom 0.254: U2.46 67.4,37.1 68.5,36 v69.25,36
EMI_D00  (via drill 0.3)
  Top 0.254: U1.41 80,29 80.75,28.25 81.25,28.25 81.75,28.75 82.5,28.75 v82.75,28.5
  Bottom 0.254: U2.2 79.75,26.75 80.25,27.25 82.25,27.25 82.75,27.75 v82.75,28.5
EMI_D01  (via drill 0.3)
  Top 0.254: U1.43 81.45,29.8 v81.75,29.5
  Bottom 0.254: U2.4 78.45,27.2 79.5,28.25 81.25,28.25 81.75,28.75 v81.75,29.5
EMI_D02  (via drill 0.3)
  Top 0.254: U1.42 80.6,29.4 v81,29
  Bottom 0.254: U2.5 77.8,27.3 79.25,28.75 80.75,28.75 v81,29
EMI_D03  (via drill 0.3)
  Top 0.254: U1.44 76.45,30.2 76,29.75 v76,28.25
  Bottom 0.254: v76,28.25 76.5,27.75 U2.7
EMI_D04  (via drill 0.3)
  Top 0.254: U1.47 76.9,31.4 75,29.5 v75,28
  Bottom 0.254: U2.8 75.85,27.15 v75,28
EMI_D05  (via drill 0.3)
  Top 0.254: U1.48 76.55,31.8 74,29.25 v74,27.75
  Bottom 0.254: U2.10 74.55,27.2 v74,27.75
EMI_D06  (via drill 0.3)
  Top 0.254: U1.49 76.2,32.2 73.25,29.25 v73.25,28.25
  Bottom 0.254: U2.11 73.9,26.85 73.25,27.5 v73.25,28.25
EMI_D07  (via drill 0.3)
  Top 0.254: U1.50 75.85,32.6 72.5,29.25 v72.5,27.75
  Bottom 0.254: U2.13 72.6,27.9 v72.5,27.75
EMI_D08  (via drill 0.3)
  Top 0.254: U1.51 v75,33
  Bottom 0.254: U2.54 72.6,36.15 75,33.75 v75,33
EMI_D09  (via drill 0.3)
  Top 0.254: U1.52 76.1,33.4 v75.75,33.75
  Bottom 0.254: U2.56 73.9,35.6 v75.75,33.75
EMI_D10  (via drill 0.3)
  Top 0.254: U1.54 77.05,34.2 v76.75,34
  Bottom 0.254: U2.57 74.55,35.95 76.5,34 v76.75,34
EMI_D11  (via drill 0.3)
  Top 0.254: U1.55 76.15,34.6 75.25,35.5 v75.25,36.5
  Bottom 0.254: v75.25,36.5 75.85,37.1 U2.59
EMI_D12  (via drill 0.3)
  Top 0.254: U1.57 77.35,35.4 v77.25,35.5
  Bottom 0.254: v77.25,35.5 76.5,36.25 U2.60
EMI_D13  (via drill 0.3)
  Top 0.254: U1.58 77.95,35.8 v77.25,36.5
  Bottom 0.254: v77.25,36.5 77.8,37.05 U2.62
EMI_D14  (via drill 0.3)
  Top 0.254: U1.60 80.9,36.6 81.25,36.25 v81.25,35.25
  Bottom 0.254: U2.63 78.45,36.8 80,35.25 v81.25,35.25
EMI_D15  (via drill 0.3)
  Top 0.254: U1.59 80.05,36.2 v80.25,36
  Bottom 0.254: U2.65 79.75,36.5 v80.25,36
EMI_DQM0  (via drill 0.3)
  Top 0.254: U1.46 80,31 v80.25,31.25
  Bottom 0.254: v80.25,31.25 78.5,29.5 72.25,29.5 70.25,27.5 68.5,27.5 68.05,27.05 U2.20
EMI_DQM1  (via drill 0.3)
  Top 0.254: U1.56 79.75,35 v80.25,34.5
  Bottom 0.254: U2.47 68.05,39.05 68.5,39.5 72.5,39.5 74,41 81.75,41 82.25,40.5 82.25,35 81.75,34.5 v80.25,34.5
EMI_DQS0  (via drill 0.3)
  Top 0.254: U1.39 77.7,28.2 v77.5,28
  Bottom 0.254: v77.5,28 76.5,29 72.5,29 70.65,27.15 U2.16
EMI_DQS1  (via drill 0.3)
  Top 0.254: v70.25,36 69.5,35.25 69.5,33.25 67.25,31 67.25,30.5 68,29.75 69.25,29.75 72,27 75.75,27 76.75,28 76.75,28.25 77.1,28.6 U1.40
  Bottom 0.254: v70.25,36 70.65,36.4 U2.51
EMI_RASN  (via drill 0.3)
  Top 0.254: U1.62 81.6,37.4 82.5,36.5 v82.5,31.25
  Bottom 0.254: U2.23 66.1,27.35 67.75,29 69,29 70.5,30.5 77.5,30.5 79.5,32.5 81.25,32.5 v82.5,31.25
EMI_WEN  (via drill 0.3)
  Top 0.254: U1.77 72.4,34.15 71,32.75 v71,29.25
  Bottom 0.254: U2.21 67.4,27.15 68.25,28 69.75,28 v71,29.25
GND  (47 unrouted)
  pour Bottom (isolate 0.305): 0,80 100,80 100,0 0,0
  pour Top (isolate 0.305): 0,80 100,80 100,0 0,0
GPMI_ALE
  Top 0.254: U3.17 65.25,6.75 70,11.5 70,15.75 72.4,18.15 U1.20
GPMI_CE0N  (via drill 0.3)
  Top 0.254: U3.9 v62.5,10.75 61.7,10.75 R14.1 | U1.82 70.4,38.4 67.25,35.25 v67.25,34.25 | v65.25,34.25 65.25,32.75 64.75,32.25 64.75,25.75 62.5,23.5 v62.5,13
  Bottom 0.254: v67.25,34.25 v65.25,34.25 | v62.5,13 v62.5,10.75
GPMI_CLE
  Top 0.254: U3.16 65,7.25 69.5,11.75 69.5,16 72,18.5 U1.19
GPMI_D00
  Top 0.254: U1.22 73.2,8.55 76.5,5.25 U3.29
GPMI_D01
  Top 0.254: U1.23 73.6,8.9 76.75,5.75 U3.30
GPMI_D02
  Top 0.254: U1.24 74,9.25 77,6.25 U3.31
GPMI_D03
  Top 0.254: U1.25 74.4,9.6 77.25,6.75 U3.32
GPMI_D04  (via drill 0.3)
  Top 0.254: U1.27 75.2,14.55 v75.5,14.25 | v75.25,12.5 76.5,11.25 U3.41
  Bottom 0.254: v75.25,12.5 75.25,14 v75.5,14.25
GPMI_D05
  Top 0.254: U1.26 74.8,13.95 77,11.75 U3.42
GPMI_D06  (via drill 0.3)
  Top 0.254: U1.29 76,16 v77.5,14.5 | U3.43 77.75,12.25 v77.5,12.5
  Bottom 0.254: v77.5,14.5 v77.5,12.5
GPMI_D07
  Top 0.254: U1.28 75.6,15.4 78.25,12.75 U3.44
GPMI_RDN  (via drill 0.3)
  Top 0.254: U3.8 67.5,11.25 68.5,12.25 68.5,14 v68.25,14.25 | U1.31 76.8,16.2 v77.25,15.75
  Bottom 0.254: v68.25,14.25 74.25,14.25 75.75,15.75 v77.25,15.75
GPMI_RDY0  (via drill 0.3)
  Top 0.254: R13.1 62.2,11.75 U3.7 67.25,11.75 68,12.5 68,13.5 67.5,14 67.5,14.75 v68,15.25 | U1.32 77.2,17.05 v78,16.25
  Bottom 0.254: v68,15.25 74.5,15.25 75.75,16.5 77.75,16.5 v78,16.25
GPMI_WPN  (via drill 0.3)
  Top 0.254: R15.2 62.7,5.75 U3.19 65.75,5.75 71,11 71,14.75 v72.25,16 | U1.34 79.8,26.2 81.25,24.75 81.25,19.5 78.75,17 v78.5,17
  Bottom 0.254: v72.25,16 74.5,16 75.5,17 v78.5,17
GPMI_WRN  (via drill 0.3)
  Top 0.254: U3.18 65.5,6.25 70.5,11.25 70.5,15.25 v72.25,17 | U1.33 79.45,25.8 80.75,24.5 80.75,20.25 78.25,17.75 v78,17.75
  Bottom 0.254: v72.25,17 74.75,17 75.25,17.5 77.75,17.5 v78,17.75
LCD_D00  (via drill 0.3)
  Top 0.254: U1.2 65.2,17.45 v64.25,16.5
  Bottom 0.254: 64.05,8 R23.2 | R23.2 R27.2 | v64.25,16.5 64,16.25 R23.2
LCD_D01  (via drill 0.3)
  Top 0.254: U1.3 65.6,16.85 v65.25,16.5
  Bottom 0.254: R26.2 R22.2 65.25,14.7 v65.25,16.5
LCD_D02  (via drill 0.3)
  Top 0.254: U1.4 66,17.5 v66.25,17.25
  Bottom 0.254: R25.2 81.05,9 76.95,9 R21.2 76,10 74.5,11.5 69.25,11.5 66.25,14.5 v66.25,17.25
LCD_D03  (via drill 0.3)
  Top 0.254: U1.5 66.4,18.1 67,17.5 v67,16.5
  Bottom 0.254: v67,16.5 67,14.5 69.5,12 74.75,12 75.5,11.25 77.7,11.25 | 77.7,11.25 R20.2 | R24.2 83.7,11.25 77.7,11.25
N$1
  Top 1.016: U7.1 82.41,68.46 C1.1 90,72.05 PWR1.+
N$2
  Top 0.254: R3.1 56,4.75 54.75,3.5 48.75,3.5 42,10.25 39.01,10.25 S2.2
  Bottom 0.254: S2.1 S2.2
N$3  (via drill 0.3)
  Top 0.254: S1.2 47.25,27.51 v47.25,31.75
  Bottom 0.254: R2.1 R1.1 50.5,35 v47.25,31.75 | S1.2 S1.1
N$4
  Top 0.254: T1.1 54.05,8 R4.2 | R4.2 R3.2 | R4.2 C6.1
N$5
  Bottom 0.254: R20.1 80.8,6.25 86.25,6.25 87.69,7.69 SW1.1
N$6
  Bottom 0.254: R21.1 78.3,5.75 86.42,5.75 90.23,9.56 SW1.2
N$7
  Bottom 0.254: R22.1 72.8,5.25 86.75,5.25 92.77,11.27 SW1.3
N$8
  Bottom 0.254: R23.1 67.3,4.75 87,4.75 95.31,13.06 SW1.4
N$9
  Top 0.254: L2.2 52.25,54 55,51.25 55,43 59.8,38.2 U1.97
N$10
  Top 0.254: RJ1.G- 4.5,16.52 4.5,23.75 5.75,25
  Top 0.406: 5.75,25 R5.2
N$11
  Top 0.254: 52,47.75 L2.1 52,45 59.85,37.4 U1.99
N$12
  Top 0.254: U1.117 60.3,30.2 60,30.5 59.5,30.5 56.75,27.75 56.75,26.25 56.5,26 C39.2
N$13
  Top 0.254: R19.1 70,22.45 U1.14
N$14
  Top 0.254: RJ1.Y- 5.25,9.14 5.25,21.2 R6.2
N$15
  Top 0.254: C75.1 40.41,35.95 Q2.2 39.41,34.95 R34.2 35.06,34.01 U4.61
N$16
  Top 0.254: L3.2 69.05,58.05 C41.2 C40.2 74.55,56.5 80.25,56.5 80.97,55.78 SD.4
N$17
  Top 0.254: RJ1.P5 15.62,10.37 RJ1.P4 19.52,9 C73.1 22.05,7.5 27,7.5 27,9
  Top 0.406: 27,9 R28.2
N$18
  Top 0.254: LED1.A 11.9,33.05 R33.2
N$19
  Top 0.254: C74.1 40.41,30.05 Q2.1 37.41,33.05 R34.1 35.55,33.5 U4.60
N$20
  Top 0.254: R35.1 20.75,38.8 U4.11
N$21
  Top 0.254: U4.63 29.05,35 R36.2
N$22
  Top 0.254: U4.12 20.25,39.8 C76.1 R37.1
N$23
  Top 0.254: R38.2 29.5,23 28.25,24.25 28.25,27.5 27.25,28.5 U4.50
N$24
  Top 0.254: R42.2 6.5,57.55 6.5,70.61 RJ2.G-
N$25  (via drill 0.3)
  Top 0.254: U4.41 22.25,26.5 v22.5,26.25 | v22,20.5 R39.2
  Bottom 0.254: v22.5,26.25 22.5,21 v22,20.5
N$26  (via drill 0.3)
  Top 0.254: v77.75,44 v81.5,40.25
  Bottom 0.254: U2.49 69.35,38.85 69.5,39 72.75,39 74.25,40.5 81.25,40.5 v81.5,40.25 | v77.75,44 78.7,43.05 R16.2 C53.2 83.55,43.05 85.25,44.75 85.8,44.75 R17.1 C52.1
N$27
  Top 0.254: R43.2 5.05,56.55 6,57.5 6,62.98 RJ2.Y-
N$28
  Top 0.254: LED3.A 6,50.95 R41.1
N$29
  Top 0.254: LED2.A 10,50.95 R40.1
N$30
  Top 0.254: RJ2.P5 16.62,68.36 RJ2.P4 20.52,67 C82.1 23.05,65.5 28,65.5 28,67 R44.2
N$31
  Top 0.254: R49.2 LED4.A
N$32
  Top 0.254: L5.2 27.4,46.9 29,48.5 U5.17
N$33  (via drill 0.3)
  Top 0.254: Q3.2 40.41,48.95 C85.1 | U5.19 30,47.26 v29.25,46.5
  Bottom 0.254: v29.25,46.5 37.96,46.5 Q3.2
N$34
  Top 0.254: U5.16 28.51,48.76 27.5,47.75 24.8,47.75 R51.1
N$35  (via drill 0.3)
  Top 0.254: U5.8 24.75,54 v24.5,54.25 | v18,56.25 18,57.95 R50.1
  Bottom 0.254: v18,56.25 20,54.25 v24.5,54.25
N$36
  Top 0.254: U5.20 30.49,47.46 R52.1
NFDX_LED
  Top 0.254: LED1.C 15.06,34.01 U4.20
NFDX_LED_2  (via drill 0.3)
  Top 0.254: U5.26 33.51,48.51 v33.25,48.25 | v38,48 38,46.05 LED4.C
  Bottom 0.254: v33.25,48.25 33.5,48 v38,48
NLNKA_LED
  Top 0.254: U4.21 16.5,33.5 14.75,31.75 8.5,31.75 1.75,25 1.75,5.69 RJ1.Y+
NLNKA_LED_2  (via drill 0.3)
  Top 0.254: U5.27 33.99,49.26 v34.25,49
  Bottom 0.254: v34.25,49 31.75,51.5 22.25,51.5 22,51.5 14.94,51.5 RJ2.Y+
NSPD_LED
  Top 0.254: RJ1.G+ 3.05,25.55 8.75,31.25 15,31.25 16.75,33 U4.22
NSPD_LED_2  (via drill 0.3)
  Top 0.254: U5.28 34.5,49.75 v35.25,49
  Bottom 0.254: v35.25,49 32.25,52 15.25,52 5.5,61.75 5.5,74.15 RJ2.G+
PRTCTL2  (via drill 0.3)
  Top 0.254: U6.1 U6.2 7.37,37.75 16,37.75 v17.25,36.5 | U4.14 19.25,36.15 v19.25,38.75
  Bottom 0.254: v19.25,38.75 18,38.75 17.25,38 v17.25,36.5
PRTCTL3
  Top 0.254: U6.3 U6.4 10.55,38.75 16.25,38.75 18.24,36.76 U4.16
PSWITCH  (via drill 0.3)
  Top 0.254: U1.119 60.1,29.4 v59.75,29.75
  Bottom 0.254: v59.75,29.75 56,33.5 C5.1 55.95,37 R2.2
RXN  (via drill 0.3)
  Top 0.254: RJ1.RD- 19.98,6 C72.1 22.05,4.5 v27,4.5 27,6 | 28,30 U4.53 28,30 | 28,30 28.5,29.5 29.5,29.5 v29.75,29.25
  Top 0.406: 27,6 R29.2
  Bottom 0.254: v29.75,29.25 29.75,28.5 28.75,27.5 28.75,6.25 v27,4.5
RXN_2  (via drill 0.3)
  Top 0.254: RJ2.RD- 20.98,64 C81.1 23.05,62.5 v25.25,62.5 28,62.5 28,64 R45.2 | U5.5 25.5,55.49 v25.25,55.25
  Bottom 0.254: v25.25,55.25 v25.25,62.5
RXP  (via drill 0.3)
  Top 0.254: RJ1.RD+ 21.14,12.9 C70.1 22.05,10.5 v27,10.5 27,12 | U4.52 27.76,29.49 28.25,29 28.75,29 v29,28.75
  Top 0.406: 27,12 R30.2
  Bottom 0.254: v29,28.75 28.25,28 28.25,11.75 v27,10.5
RXP_2  (via drill 0.3)
  Top 0.254: RJ2.RD+ 22.14,70.91 C79.1 23.05,68.5 v26.5,68.5 28,68.5 28,70 R46.2 | U5.6 26.51,55.01 v26.25,54.75
  Bottom 0.254: v26.25,54.75 26.25,68.5 v26.5,68.5
SSP1_CMD  (via drill 0.3)
  Top 0.254: R11.1 79.75,58 80.87,56.88 v84.75,56.88 SD.3 | U1.83 70,43 73,46 75,46 75.25,45.75 76.75,45.75 77.25,46.25 80.25,46.25 v83.75,49.75
  Bottom 0.254: v84.75,56.88 84.75,50.75 v83.75,49.75
SSP1_DATA0  (via drill 0.3)
  Top 0.254: U1.84 69.6,43.35 72.75,46.5 v76.25,46.5 | v75.5,49.75 75.5,50 76.75,51.25 79.25,51.25 79.95,50.55 R10.1 80.6,50.65 81.9,50.65 83.75,52.5 92.38,52.5 SD.7
  Bottom 0.254: v75.5,49.75 75.5,46.75 75.75,46.5 v76.25,46.5
SSP1_DATA1
  Top 0.254: U1.85 69.2,43.7 72.75,47.25 76.75,47.25 77.25,46.75 79,46.75 79.75,47.5 79.75,47.8 R9.1 83.33,51.38 SD.8
SSP1_DATA2  (via drill 0.3)
  Top 0.254: U1.86 68.8,44.05 72.5,47.75 73.5,47.75 74.75,49 74.75,50 76.5,51.75 79.75,51.75 v80,51.5 | R8.1 78.5,62 v81.42,59.08 SD.1
  Bottom 0.254: v80,51.5 80,52 81.25,53.25 81.25,58.91 v81.42,59.08
SSP1_DATA3  (via drill 0.3)
  Top 0.254: U1.87 68.4,44.4 72.25,48.25 73.25,48.25 74.25,49.25 74.25,50.25 76.25,52.25 80.75,52.25 v81,52 | R12.2 79,60 81,58 v82.25,58 92.38,58 SD.2
  Bottom 0.254: v81,52 82.25,53.25 v82.25,58
SSP1_SCK
  Top 0.254: U1.90 67.2,44.7 69.5,47 69.5,50.5 70.5,51.5 74.75,51.5 76.1,52.85 82.35,52.85 84.18,54.68 SD.5
TXN  (via drill 0.3)
  Top 0.254: RJ1.TD- 17.71,15 C69.1 22.05,13.5 v27,13.5 27,15 | U4.56 29.5,31.5 v29.75,31.25
  Top 0.406: 27,15 R31.2
  Bottom 0.254: v27,13.5 27.75,14.25 27.75,28.5 29.75,30.5 v29.75,31.25
TXN_2  (via drill 0.3)
  Top 0.254: RJ2.TD- 18.71,73 C78.1 23.05,71.5 v24,71.5 28,71.5 28,73 R47.2 | U5.2 25.26,56.99 25,57.25 25,59 23.75,60.25 v23.75,60.5
  Bottom 0.254: v23.75,60.5 23.75,71.5 v24,71.5
TXP  (via drill 0.3)
  Top 0.254: RJ1.TD+ 16.91,18 C71.1 22.05,16.5 v27,16.5 27,17.95 | 27,17.95 27,18 | R32.2 27,17.95 | U4.55 26.41,31 28.75,31 v29,30.75
  Top 0.406: 27,18 R32.2
  Bottom 0.254: v27,16.5 27,28.75 v29,30.75
TXP_2  (via drill 0.3)
  Top 0.254: RJ2.TD+ 17.91,76 C80.1 23.05,74.5 v23.25,74.5 28,74.5 28,76 R48.2 | U5.3 24.99,56.51 24.5,57 24.5,58.5 v22.5,60.5
  Bottom 0.254: v22.5,60.5 22.5,73.75 v23.25,74.5
USB_DM  (via drill 0.3)
  Top 0.254: U1.123 59.8,27.8 58.75,26.75 v58.75,23.75 | U4.58 33.74,32.51 38.75,27.5 v38.75,27
  Bottom 0.254: v58.75,23.75 52.5,23.75 49.75,26.5 39.25,26.5 v38.75,27
USB_DM2  (via drill 0.3)
  Top 0.254: U4.1 25.76,36.76 28.25,39.25 32.75,39.25 33.25,38.75 v33.25,36
  Bottom 0.254: X1.2 35.25,10.46 35.25,20.5 37.25,22.5 37.25,34.75 36,36 v33.25,36
USB_DM3  (via drill 0.3)
  Top 0.254: U4.3 24.74,37.24 25.25,37.75 v25.25,38.75 | U5.11 26.25,52.5 25.25,51.5 v25.25,49
  Bottom 0.254: v25.25,49 v25.25,38.75
USB_DP  (via drill 0.3)
  Top 0.254: U1.124 60.15,27.4 59.5,26.75 v59.5,24.5 | v39.75,27.25 34,33 U4.59
  Bottom 0.254: v39.75,27.25 49.75,27.25 52.5,24.5 v59.5,24.5
USB_DP2  (via drill 0.3)
  Top 0.254: U4.2 25.25,37 28,39.75 33,39.75 34,38.75 34,35.5 v33.75,35.25
  Bottom 0.254: X1.3 34.75,8.96 34.75,20.75 36.75,22.75 36.75,34.5 35.75,35.5 34,35.5 v33.75,35.25
USB_DP3  (via drill 0.3)
  Top 0.254: U4.4 24.26,37.76 v24.5,38 | U5.12 26.49,51.99 26,51.5 v26,50.75
  Bottom 0.254: v24.5,38 24.5,49.25 v26,50.75
USB_PWRA  (via drill 0.3)
  Top 0.254: R41.2 6.09,47.95 U6.8 4.85,44.6 v4.75,44.5
  Bottom 0.254: v4.75,44.5 7.25,44.5 9,46.25 21.25,46.25 22.5,45 22.5,37.5 23.25,36.75 36,36.75 37.75,35 37.75,10.46 X1.1
USB_PWRB
  Top 0.254: R40.2 9.9,47.95 U6.5
VDD3V3A  (via drill 0.3)
  Top 0.254: R29.1 R28.1 R30.1 R31.1 R32.1 v30.25,18 | 31.05,28 C57.1 C8.1 v29.5,25 | 31.05,28 C54.1 | C54.1 31.05,30 | 31.05,30 C56.1 | U4.57 30.05,32 C56.1 | C58.1 23.75,39.8 | v23.75,38.75 U4.5 | U4.10 21.25,36.16 21.25,37.25 | 21.25,37.25 21.25,38.25 21.75,38.75 v23.75,38.75 | C58.1 C55.1 26.39,39.66 | C7.1 28.75,36.7 28.75,35.75 28.51,35.51 U4.64 26.76,35.51 v27.25,36 | R48.1 R47.1 R46.1 R44.1 R45.1 29.95,62.95 28.25,61.25 22,61.25 21.75,61 21.75,60.25 22.95,59.05 C87.1 | U5.4 C87.1 | C87.1 C86.1 | C86.1 23.46,53.49 U5.9 | C86.1 C88.1 C89.1 22.95,48.3 23,48.25 | U5.15 28,49 27.25,48.25 23,48.25 | 23,48.25 v21,48.25 20,47.25 L6.2 | v23.75,38.75 23.75,39.8 | 23.75,39.8 arc-90 C58.1 | C54.1 | 30.8,30.75 C56.1 | U4.49 26.39,25 | 26.39,25 26.39,24.29 L1.2 28.9,21 v30.25,21 | U4.54 28.25,30.5 28.75,30 31.05,30 | U4.51 27.49,29.01 28.5,28 31.05,28 | v21.75,37.25 21.25,37.25 | v25.5,25 26.39,25
  Bottom 0.254: v21,48.25 23.75,45.5 v23.75,38.75 | v21.75,37.25 22,37.25 23.25,36 v27.25,36 27.25,30.75 24.75,28.25 24.75,25.5 25.25,25 v25.5,25 | v29.5,25 29.5,21.75 v30.25,21 v30.25,18
VDD4P2  (via drill 0.3)
  Top 0.254: 55,32.05 C17.1 | C17.1 54.95,31.25 | 54.95,31.25 C16.1 | U1.101 61.1,36.6 v60.75,36.25 | v60.5,34.25 60.5,33 60,32.5 C17.1 | D1.C 49,28.5 51.75,31.25 54.95,31.25
  Bottom 0.254: v60.75,36.25 60.5,36 v60.5,34.25
VDD18CORE  (via drill 0.3)
  Top 0.254: C60.1 18,24.25 v18.88,25.12 19,25.25 20.25,25.25 20.75,25.75 U4.38 | C61.1 C59.1 16,39.75 18.25,37.5 | U4.15 18.75,37 18.38,37.38 18.25,37.5 | v18.25,37.75 18.25,37.5
  Bottom 0.254: v18.25,37.75 18.25,25.75 v18.88,25.12
VDD18ETHPLL  (via drill 0.3)
  Top 0.254: C67.1 38.05,23.05 L4.2 v35,25 | U4.48 25.76,26.26 v25.5,26
  Bottom 0.254: v35,25 35,28 31,32 29.25,32 25.5,28.25 v25.5,26
VDD18USBPLL  (via drill 0.3)
  Top 0.254: C68.1 37.9,25 L4.1 34.5,28.4 v34.5,29.75 | U4.62 34.24,34.49 v34.5,34.75
  Bottom 0.254: v34.5,34.75 v34.5,29.75
VDDCORE  (via drill 0.3)
  Top 0.254: C95.1 33,62.05 L7.1 31.35,62.1 v31.25,62 | C83.1 23.3,43.75 24.65,43.75 L5.1 26.85,45.1 v27.5,45.75 | U5.21 31,48.95 v31.48,48.48 C97.1 C96.1 36.25,48.2 v36.25,49 | U5.50 v31,59.25
  Bottom 0.254: v27.5,45.75 27.5,47 28.25,47.75 30.75,47.75 v31.48,48.48 | v31.25,62 31,61.75 v31,59.25 31,54.25 v36.25,49
VDDIO_DRAM  (via drill 0.3)
  Top 0.254: U1.45 84.05,30.6 C14.1 | v84,26.5 84.05,26.55 C13.1 C14.1 | v82,28 81.8,27.8 U1.38 | v84,33.25 84,31.05 C14.1 | U1.53 81.2,33.8 v81.25,33.75 | v81.5,39.25 83,39.25 v83.5,38.75
  Bottom 0.254: C51.2 80.4,23.35 U2.1 80.83,26.5 v84,26.5 | C51.2 79.1,23.85 U2.3 79.1,27.1 79.75,27.75 81.75,27.75 v82,28 | C47.2 C48.2 | C48.2 C49.2 | C49.2 C50.2 C51.2 | U2.9 75.2,23.15 C49.2 | U2.15 71.3,23.15 C48.2 | U2.18 69.35,23.3 C47.2 | U2.33 59.6,25.4 62,23 63.95,23 C46.2 64.3,22.95 66,21.25 66.3,21.25 R18.2 C47.2 | U2.55 73.25,38.75 74.5,40 77.15,40 | v81.25,33.75 83.5,33.75 v84,33.25 84,38.25 v83.5,38.75 84.7,39.95 C44.2 | 77.15,40 80.75,40 v81.5,39.25 | U2.61 77.15,40 | C52.2 R17.2 C44.2 | C44.2 C45.2
VDDM/LRADC4
  Top 0.254: C15.1 56.25,28 61,32.75 61,33.75 61.85,34.6 U1.106
VDDPLL2  (via drill 0.3)
  Top 0.254: C99.1 v33.05,65 33.05,63.9 L7.2 | U5.10 24.5,53.01 v24.25,52.75
  Bottom 0.254: v24.25,52.75 25.5,54 26.75,54 27.25,54.5 27.25,59.2 v33.05,65
VDDXTAL
  Top 0.254: U1.120 58.75,29 57.25,27.5 57.25,24.75 56.5,24 C34.1 52.7,21.75 46.01,21.75 S1.4
  Bottom 0.254: S1.4 S1.3
XI  (via drill 0.3)
  Top 0.254: Q3.1 40.41,43.05 C84.1 | v29.5,45.5 29,45.5 28.5,46 28.5,47 29.5,48 U5.18
  Bottom 0.254: Q3.1 37.71,45.75 29.75,45.75 v29.5,45.5
XTALI
  Top 0.254: T1.3 58.9,16 C35.2 59.54,16.49 Q1.2 59.5,19.75 57.25,22 57.25,23.25 58.25,24.25 58.25,27 59.45,28.2 U1.122
XTALO
  Top 0.254: T2.3 54.95,15.8 C36.2 54.46,16.49 Q1.1 54.46,21.21 57.75,24.5 57.75,27.25 59.1,28.6 U1.121

## Text on the board
tPlace: LinuxBoard v1.9 / 20150306 | C:/Users/mwojciga/Downloads/logo_2015_bw_with_name.bmp | SD: 1001 | NAND: 0100 | 3 | 2 | 1 | 0